# Altium project FEU31_Part2.PrjPcb
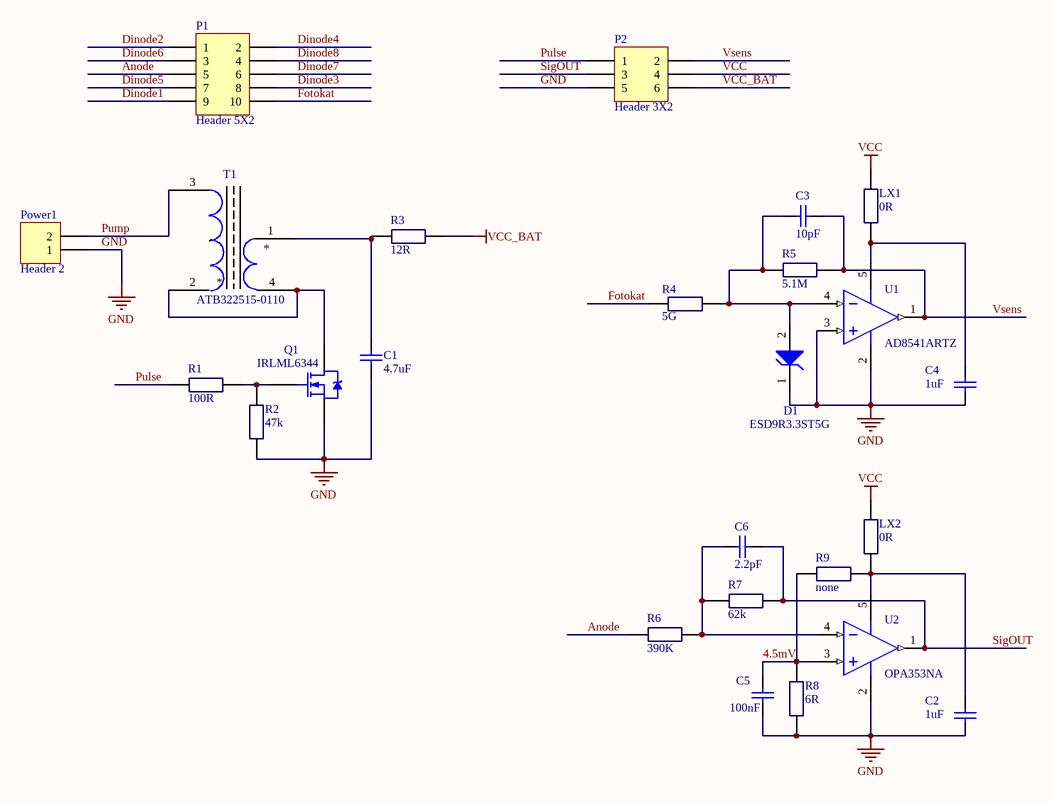
[diagram p0: FEU31_Part2.SchDoc]
1 sheet, 25 parts. Net scope: global (net labels, ports and power ports of the same name join across sheets).
Board file: FEU31_Part2.PcbDoc

## Sheet FEU31_Part2.SchDoc: Интерфейсный модуль ФЭУ-102
size A3; Address1: (с) Быканов Андрей; Address2: г.Тула 2016г.; Revision: 1.3

### Parts
C1  4.7uF  [C1206]
C2  1uF  [1608[0603]_CAP]
C3  10pF  [1608[0603]]
C4  1uF  [1608[0603]_CAP]
C5  100nF  [1608[0603]_CAP]
C6  2.2pF  [1608[0603]]
D1  ESD9R3.3ST5G  [ONSC-SOD-923-2-514AB-01_V]
LX1  0R  [1608[0603]]
LX2  0R  [1608[0603]]
P1  Header 5X2  [ФЭУ-31]
P2  Header 3X2  [HDR2X3]
Power1  Header 2  [HDR1X2]
Q1  IRLML6344  [SOT-23_N]
R1  100R  [1608[0603]_RES]
R2  47k  [1608[0603]_RES]
R3  12R  [1608[0603]_RES]
R4  5G  [HVF2512T5007FE]
R5  5.1M  [1608[0603]_RES]
R6  390K  [1608[0603]_RES]
R7  62k  [1608[0603]_RES]
R8  6R  [1608[0603]_RES]
R9  none  [1608[0603]_RES]
T1  ATB322515-0110  [ATB322515-0110]
U1  AD8541ARTZ  [ADI-RJ-5_N]
U2  OPA353NA  [ADI-RJ-5_N]

### Nets
GND: C1.2 C2.2 C4.2 C5.2 D1.1(K) P2.5 Power1.1 Q1.2(S) R2.1(A) R8.1(A) U1.2(-V) U1.3(+IN_A) U2.2(-V)
VCC: LX1.1(A) LX2.1(A) P2.4
VCC_BAT: P2.6 R3.2
4.5mV: C5.1 R8.2 R9.1(A) U2.3(+IN_A)
Anode: P1.5 R6.2
Dinode1: P1.9
Dinode2: P1.1
Dinode3: P1.8
Dinode4: P1.2
Dinode5: P1.7
Dinode6: P1.3
Dinode7: P1.6
Dinode8: P1.4
Fotokat: P1.10 R4.1(A)
Pulse: P2.1 R1.1(A)
Pump: Power1.2 T1.3
SigOUT: C6.2 P2.3 R7.2 U2.1(OUT_A)
Vsens: C3.2 P2.2 R5.2 U1.1(OUT_A)
NetC1_1: C1.1 R3.1(A) T1.1
NetC2_1: C2.1 LX2.2 R9.2 U2.5(+V)
NetC3_1: C3.1 D1.2(A) R4.2 R5.1(A) U1.4(-IN_A)
NetC4_1: C4.1 LX1.2 U1.5(+V)
NetC6_1: C6.1 R6.1(A) R7.1(A) U2.4(-IN_A)
NetQ1_1: Q1.1(G) R1.2 R2.2
NetQ1_3: Q1.3(D) T1.2 T1.4

### Notes on the sheet
- Title
- Size:
- Date:
- A3
- Number:
- Time:
- Revision:
- Sheet
- of
- File:

### Library data of the parts
C1 = Cap Semi: Capacitor (Semiconductor SIM Model); Order: CC1206KKX7R8BB475; Published: 8-Jun-2000; LatestRevisionDate: 29-May-2009; LatestRevisionNote: IPC-7351 Footprint Added.; PackageReference: C1206; Publisher: Altium Limited; PackageDescription: Chip Capacitor; Value: 4.7uF
C2 C4 = Cap Semi: Capacitor (Semiconductor SIM Model); Order: CC0603KRX5R7BB105; Published: 8-Jun-2000; LatestRevisionDate: 29-May-2009; LatestRevisionNote: IPC-7351 Footprint Added.; PackageReference: C1206; Publisher: Altium Limited; PackageDescription: Chip Capacitor; Value: 1uF
C3 = Cap Semi: Capacitor (Semiconductor SIM Model); Order: CC0603JRNPO9BN100; Published: 8-Jun-2000; LatestRevisionDate: 29-May-2009; LatestRevisionNote: IPC-7351 Footprint Added.; PackageReference: C1206; Publisher: Altium Limited; PackageDescription: Chip Capacitor; Value: 10pF
C5 = Cap Semi: Capacitor (Semiconductor SIM Model); Order: GRM188R71E104KA01D; Published: 8-Jun-2000; LatestRevisionDate: 29-May-2009; LatestRevisionNote: IPC-7351 Footprint Added.; PackageReference: C1206; Publisher: Altium Limited; PackageDescription: Chip Capacitor; Value: 100nF
C6 = Cap Semi: Capacitor (Semiconductor SIM Model); Order: CC0603CRNPO9BN2R2; Published: 8-Jun-2000; LatestRevisionDate: 29-May-2009; LatestRevisionNote: IPC-7351 Footprint Added.; PackageReference: C1206; Publisher: Altium Limited; PackageDescription: Chip Capacitor; Value: 2.2pF
D1 = ESD9R3.3ST5G: Transient Voltage Suppressor, ESD Protection Diode with Ultra-Low Leakage, 2-Pin SOD-923, Pb-Free, Tape and Reel; Manufacturer: On Semiconductor; C Max (pF): 0.9; Direction: Unidirectional; IR Max (uA): 0.001; Number of Lines: 1; V(BR) Min (V): 4.8; VRWM Max (V): 3.3; DatasheetVersion: Rev. 1; PackageVersion: Rev. C, 03/2011; PackageReference: SOD-923-2-514AB-01; PackageDescription: 2-Pin SOD, Body 0.8 x 0.6 mm; Supplier 1: Digi-Key; Supplier Part Number 1: ESD9R3.3ST5GOSTR-ND; Supplier 2: Digi-Key; Supplier Part Number 2: ESD9R3.3ST5GOSCT-ND; Supplier 3: Digi-Key; Supplier Part Number 3: ESD9R3.3ST5GOSDKR-ND; Supplier 4: Farnell; Supplier Part Number 4: 2101835; Supplier 5: Mouser; Supplier Part Number 5: 863-ESD9R3.3ST5G; Packing: Tape and Reel; RoHS: Pb-Free; Mounting Technology: Surface Mount; PartNumber: ESD9R3.3ST5G; ComponentLink1Description: Manufacturer URL; ComponentLink1URL: http://www.onsemi.com/; ComponentLink2Description: Datasheet; ComponentLink2URL: http://www.onsemi.com/pub_link/Collateral/ESD9R3.3S-D.PDF; ComponentLink3Description: Package Specification; ComponentLink3URL: http://www.onsemi.com/pub_link/Collateral/514AB.PDF; Order: ESD9R3.3ST5G
LX1 LX2 = Resistor 0805: Order: RC0603JR-100RL; Value: 0R
P1 = Header 5X2: Header, 5-Pin, Dual row; LatestRevisionDate: 17-Jul-2002; LatestRevisionNote: Re-released for DXP Platform.; Publisher: Altium Limited
P2 = Header 3X2: Header, 3-Pin, Dual row; LatestRevisionDate: 17-Jul-2002; LatestRevisionNote: Re-released for DXP Platform.; Publisher: Altium Limited
Power1 = Header 2: Header, 2-Pin; LatestRevisionDate: 17-Jul-2002; LatestRevisionNote: Re-released for DXP Platform.; Publisher: Altium Limited
Q1 = IRLML2402: HEXFET Power MOSFET; Published: 8-Jun-2000; LatestRevisionDate: 20-Nov-2009; LatestRevisionNote: IPC-7351 Footprint Added.; DatasheetVersion: Aug-1997; PackageReference: SOT-23; Publisher: Altium Limited; PackageDescription: 3-Pin SOT-23 Package 0.95 mm Pitch, 2.3 mm Lead Span; ComponentLink1Description: Manufacturer Link; ComponentLink1URL: http://www.irf.com/; ComponentLink2Description: Datasheet; ComponentLink2URL: http://www.irf.com/product-info/datasheets/data/irlml2402.pdf; Order: IRLML6344
R1 = Resistor 0805: Order: RC0603JR-07100RL; Avail: 20; Value: 100R
R2 = Resistor 0805: Order: RC0603FR-0747KL; Avail: 20; Value: 47k
R3 = Resistor 0805: Order: ERJ3GEYJ120V; Avail: 20; Value: 12R
R4 R9 = Resistor 0805
  R4: Order: HVF2512T5007FE; Value: 5G
  R9: Order: none; Value: none
R5 = Resistor 0805: Order: RC0603FR-075M1L; Value: 5.1M
R6 = Resistor 0805: Order: RC0603FR-07390KL; Avail: 20; Value: 390K
R7 = Resistor 0805: Order: RC0603JR-0762KL; Value: 62k
R8 = Resistor 0805: Order: RC0603JR-076RL; Value: 6R
U1 U2 = AD8541ARTZ-R2: Single Channel RRIO Operational Amplifier, 1 MHz BW, 920 mV/us SR, Industrial, 5-pin SOT23 (RJ-5), Reel; Generic Part Number: AD8541; Manufacturer: Analog Devices; Amplifiers Per Package: 1; Input Bias Current: 4pA; Input Offset Voltage: 1mV; Iq/Amp: 65uA; Small Signal Bandwidth: 1MHz; V Span Max: 5.5V; V Span Min: 2.7V; DatasheetVersion: Rev. G; PackageVersion: 121608-A; PackageReference: RJ-5; PackageDescription: 5-Pin Small Outline Transistor Package, Body 2.9 x 1.6 mm, Pitch 0.95 mm; Supplier 1: Digi-Key; Supplier Part Number 1: AD8541ARTZ-R2TR-ND; Supplier 2: Digi-Key; Supplier Part Number 2: AD8541ARTZ-R2CT-ND; Supplier 3: Digi-Key; Supplier Part Number 3: AD8541ARTZ-R2DKR-ND; Supplier 4: Farnell; Supplier Part Number 4: 1837434; Supplier 5: Newark; Supplier Part Number 5: 59K6820; Slew Rate: 920mV/us; Mounting Technology: Surface Mount; Code_JEDEC: MO-178-AA; PartNumber: AD8541ARTZ-R2; ComponentLink1Description: Manufacturer URL; ComponentLink1URL: http://www.analog.com/en/index.html; ComponentLink2Description: Datasheet; ComponentLink2URL: http://www.analog.com/static/imported-files/data_sheets/AD8541_8542_8544.pdf; ComponentLink3Description: Package Specification; ComponentLink3URL: http://www.analog.com/static/imported-files/packages/PKG_PDF/SOT-23(RJ)/RJ_5.pdf; ComponentLink4Description: Reference Circuit; ComponentLink4URL: http://www.analog.com/en/all-operational-amplifiers-op-amps/operational-amplifiers-op-amps/ad8541/products/product.html#product-recommendations
  U1: Order: AD8541ARTZ
  U2: Order: OPA353NA
T1 = ATB322515-0110: Order: ATB322515-0110